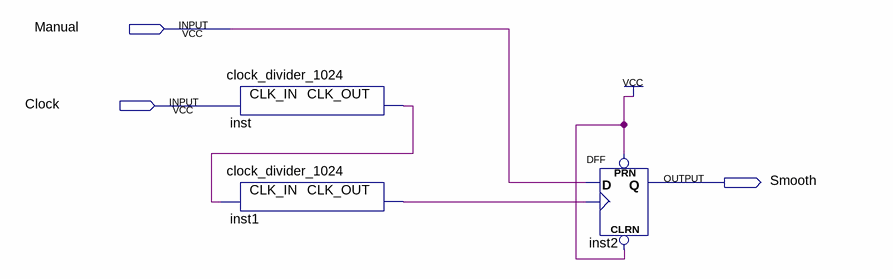
[diagram p0: schematic sheet]
// Quartus schematic Debouncer.bdf as structural Verilog: 3 symbols, 3 pins
module Debouncer (
  input  Manual,
  input  Clock,
  output Smooth
);

  wire inst1_clk_out, inst_clk_out;

  clock_divider_1024 inst (.CLK_IN(Clock), .CLK_OUT(inst_clk_out));
  clock_divider_1024 inst1 (.CLK_IN(inst_clk_out), .CLK_OUT(inst1_clk_out));
  DFF inst2 (.CLRN(1'b1), .CLK(inst1_clk_out), .D(Manual), .PRN(1'b1), .Q(Smooth));
endmodule
